# EAGLE schematic ExtensionBoard (EAGLE 6.5.0)
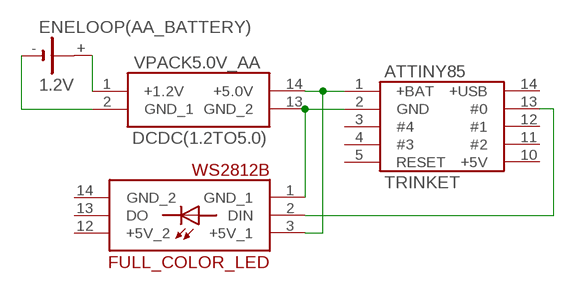
[diagram p0: schematic, sheet 1]

## Parts
ATTINY85  TRINKET  [DIL10]
ENELOOP(AA_BATTERY)  1.2V  1V60R  [1V60R]
VPACK5.0V_AA  DCDC(1.2TO5.0)  [DIL4]
WS2812B  FULL_COLOR_LED  [DIL6]

## Nets
N$1: ENELOOP(AA_BATTERY).+ VPACK5.0V_AA.1(+1.2V)
N$2: ENELOOP(AA_BATTERY).- VPACK5.0V_AA.2(GND_1)
N$3: ATTINY85.1(+BAT) VPACK5.0V_AA.14(+5.0V) WS2812B.3(+5V_1)
N$4: ATTINY85.2(GND) VPACK5.0V_AA.13(GND_2) WS2812B.1(GND_1)
N$5: ATTINY85.13(#0) WS2812B.2(DIN)
Unconnected: ATTINY85.3(#4) ATTINY85.4(#3) ATTINY85.5(RESET) ATTINY85.10(+5V) ATTINY85.11(#2) ATTINY85.12(#1) ATTINY85.14(+USB) ENELOOP(AA_BATTERY).+@1(+) WS2812B.12(+5V_2) WS2812B.13(DO) WS2812B.14(GND_2)

## Library data of the parts
ATTINY85 = adafruit:TRINKET
ENELOOP(AA_BATTERY) = battery:1V60R: NC ACCU Varta
VPACK5.0V_AA = adafruit:DCDC(1.2TO5.0)
WS2812B = adafruit:FULL_COLOR_LED